# Altium schematic sheet POWER.SchDoc
size A4; SheetNumber: 3; SheetTotal: 3
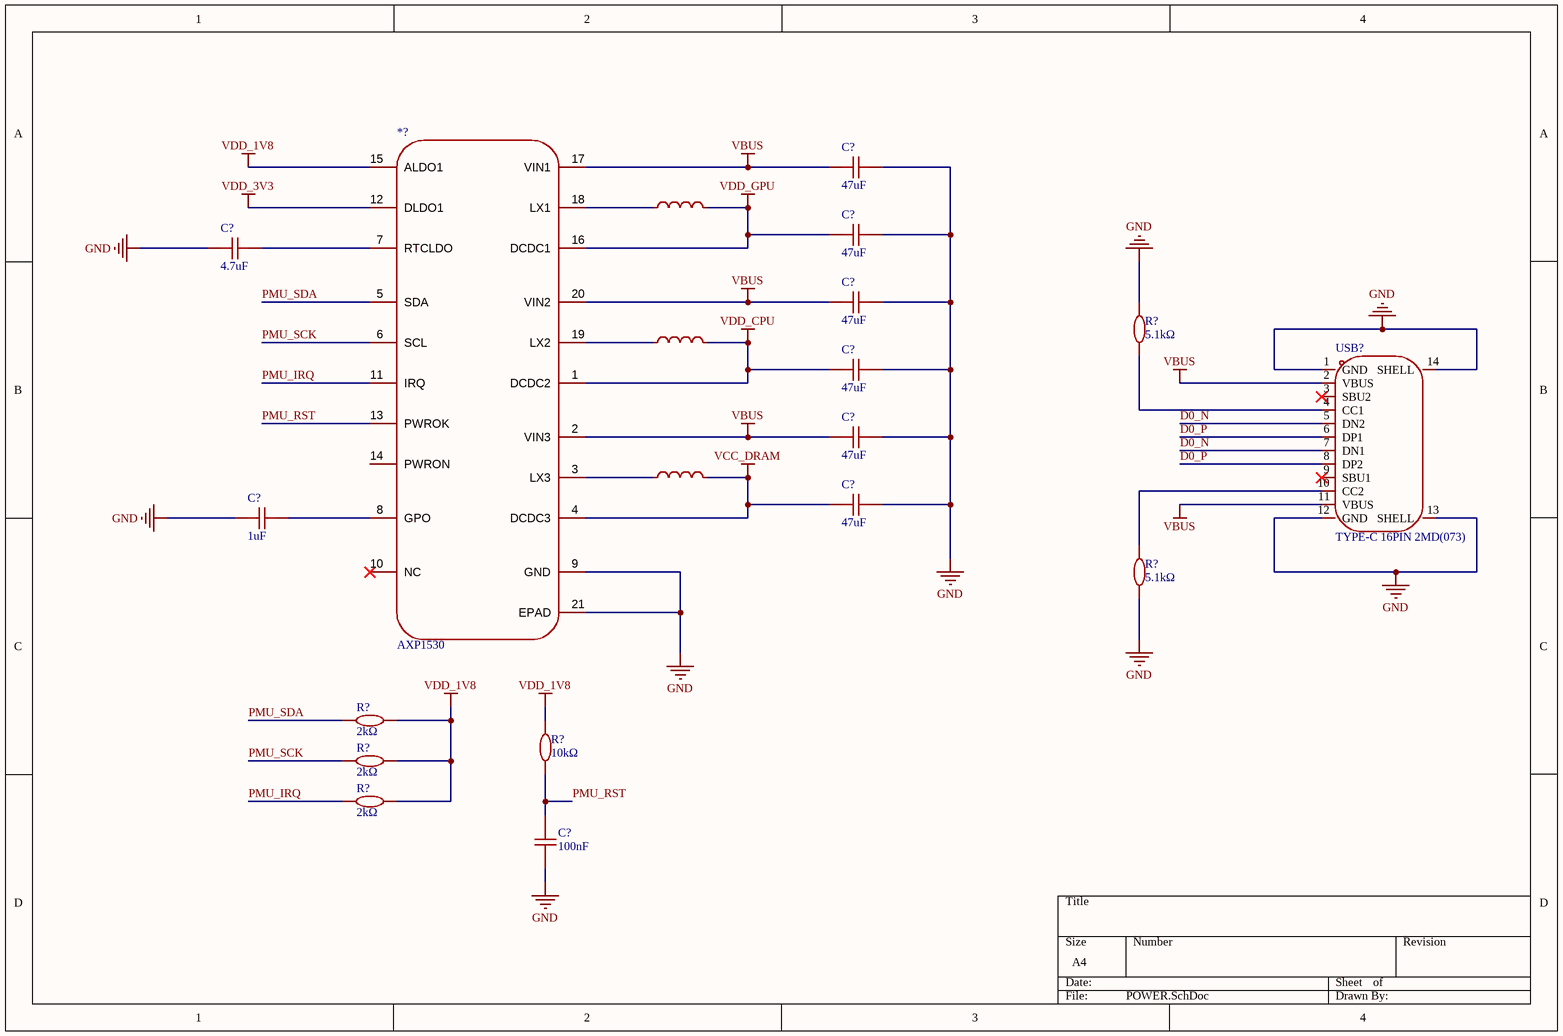
[diagram p0: POWER.SchDoc]

## Parts
(Parts that share a designator on the sheet are numbered #1, #2 ... from top to bottom, then left to right.)
*?  AXP1530  [QFN-20_L3.0-W3.0-P0.40-BL-EP1.7]
C?#1  47uF  [C0603]
C?#2  47uF  [C0603]
C?#3  4.7uF  [C0402]
C?#4  47uF  [C0603]
C?#5  47uF  [C0603]
C?#6  47uF  [C0603]
C?#7  47uF  [C0603]
C?#8  1uF  [C0402]
C?#9  100nF  [C0402]
L?#1  1uH  [IND-SMD_L4.0-W4.0]  (value not drawn)
L?#2  1uH  [IND-SMD_L4.0-W4.0]  (value not drawn)
L??  1uH  [IND-SMD_L4.0-W4.0]  (value not drawn)
R?#1  5.1kΩ  [R0402]
R?#2  5.1kΩ  [R0402]
R?#3  2kΩ  [R0402]
R?#4  10kΩ  [R0402]
R?#5  2kΩ  [R0402]
R?#6  2kΩ  [R0402]
USB?  TYPE-C 16PIN 2MD(073)  [USB-C-SMD_TYPE-C-6PIN-2MD-073]

## Nets
GND: *?.9(GND) *?.21(EPAD) C?#1.2 C?#2.2 C?#3.1 C?#4.2 C?#5.2 C?#6.2 C?#7.2 C?#8.1 C?#9.1 R?#1.2 R?#2.2 USB?.1(GND) USB?.12(GND) USB?.13(SHELL) USB?.14(SHELL)
VBUS: *?.2(VIN3) *?.17(VIN1) *?.20(VIN2) C?#1.1 C?#4.1 C?#6.1 USB?.2(VBUS) USB?.11(VBUS)
VCC_DRAM: *?.4(DCDC3) C?#7.1 L?#2.2
VDD_1V8: *?.15(ALDO1) R?#3.2 R?#4.2 R?#5.2 R?#6.2
VDD_3V3: *?.12(DLDO1)
VDD_CPU: *?.1(DCDC2) C?#5.1 L?#1.2
VDD_GPU: *?.16(DCDC1) C?#2.1 L??.2
D0_N: USB?.5(DN2) USB?.7(DN1)
D0_P: USB?.6(DP1) USB?.8(DP2)
PMU_IRQ: *?.11(IRQ) R?#6.1
PMU_RST: *?.13(PWROK) C?#9.2 R?#4.1
PMU_SCK: *?.6(SCL) R?#5.1
PMU_SDA: *?.5(SDA) R?#3.1
Net*?_3: *?.3(LX3) L?#2.1
Net*?_7: *?.7(RTCLDO) C?#3.2
Net*?_8: *?.8(GPO) C?#8.2
Net*?_18: *?.18(LX1) L??.1
Net*?_19: *?.19(LX2) L?#1.1
NetR?#1_1: R?#1.1 USB?.4(CC1)
NetR?#2_1: R?#2.1 USB?.10(CC2)

Not connected (* = marked no-connect by the designer): *? 10(NC)* 14(PWRON); USB? 3(SBU2)* 9(SBU1)*

## Library data of the parts
*? = AXP1530: AXP313A; Symbol: AXP1530
C?#1 C?#2 C?#4-C?#7 = 47uF: 16V 22uF X5R ±20% 0603 Ceramic Capacitors ROHS
C?#3 = 4.7uF: 10V 4.7uF X5R ±20% 0402 Ceramic Capacitors ROHS
C?#8 = 1uF: 50V 1uF X5R ±10% 0402 Ceramic Capacitors ROHS
C?#9 = 100nF: 50V 100nF X7R ±10% 0402 Ceramic Capacitors ROHS
L?#1 L?#2 L?? = SLW4030S1R0NST: 4.15A 1uH ±30% 18mΩ SMD,4x4mm Fixed Inductors ROHS; Manufacturer: Sunltech(顺磁); Add into BOM: yes; Symbol: SLW4030S1R0NST; Device: SLW4030S1R0NST; LCSC Part Name: 1uH ±30%; Supplier Part: C206354; Manufacturer Part: SLW4030S1R0NST; Supplier Footprint: SMD,4x4mm; JLCPCB Part Class: Extended Part; Datasheet: https://item.szlcsc.com/datasheet/SLW4030S1R0NST/207399.html; Supplier: LCSC; Convert to PCB: yes; Value: 1uH; Tolerance: ±30%; Current Rating: 4.15A; DC Resistance(DCR): 18mΩ
R?#1 R?#2 = 5.1kΩ: 5.1kΩ 62.5mW 50V ±100ppm/℃ Thick Film Resistor ±1% 0402 Chip Resistor - Surface Mount ROHS
R?#3 R?#5 R?#6 = 2kΩ: 100mW 2kΩ 75V ±100ppm/℃ Thick Film Resistor ±1% 0402 Chip Resistor - Surface Mount ROHS
R?#4 = 10kΩ: 62.5mW 10kΩ 50V ±100ppm/℃ Thick Film Resistor ±1% 0402 Chip Resistor - Surface Mount ROHS
USB? = TYPE-C 16PIN 2MD(073): 16pin type-c